# Altium project Syncbox.PrjPcb (part 2 of 4)
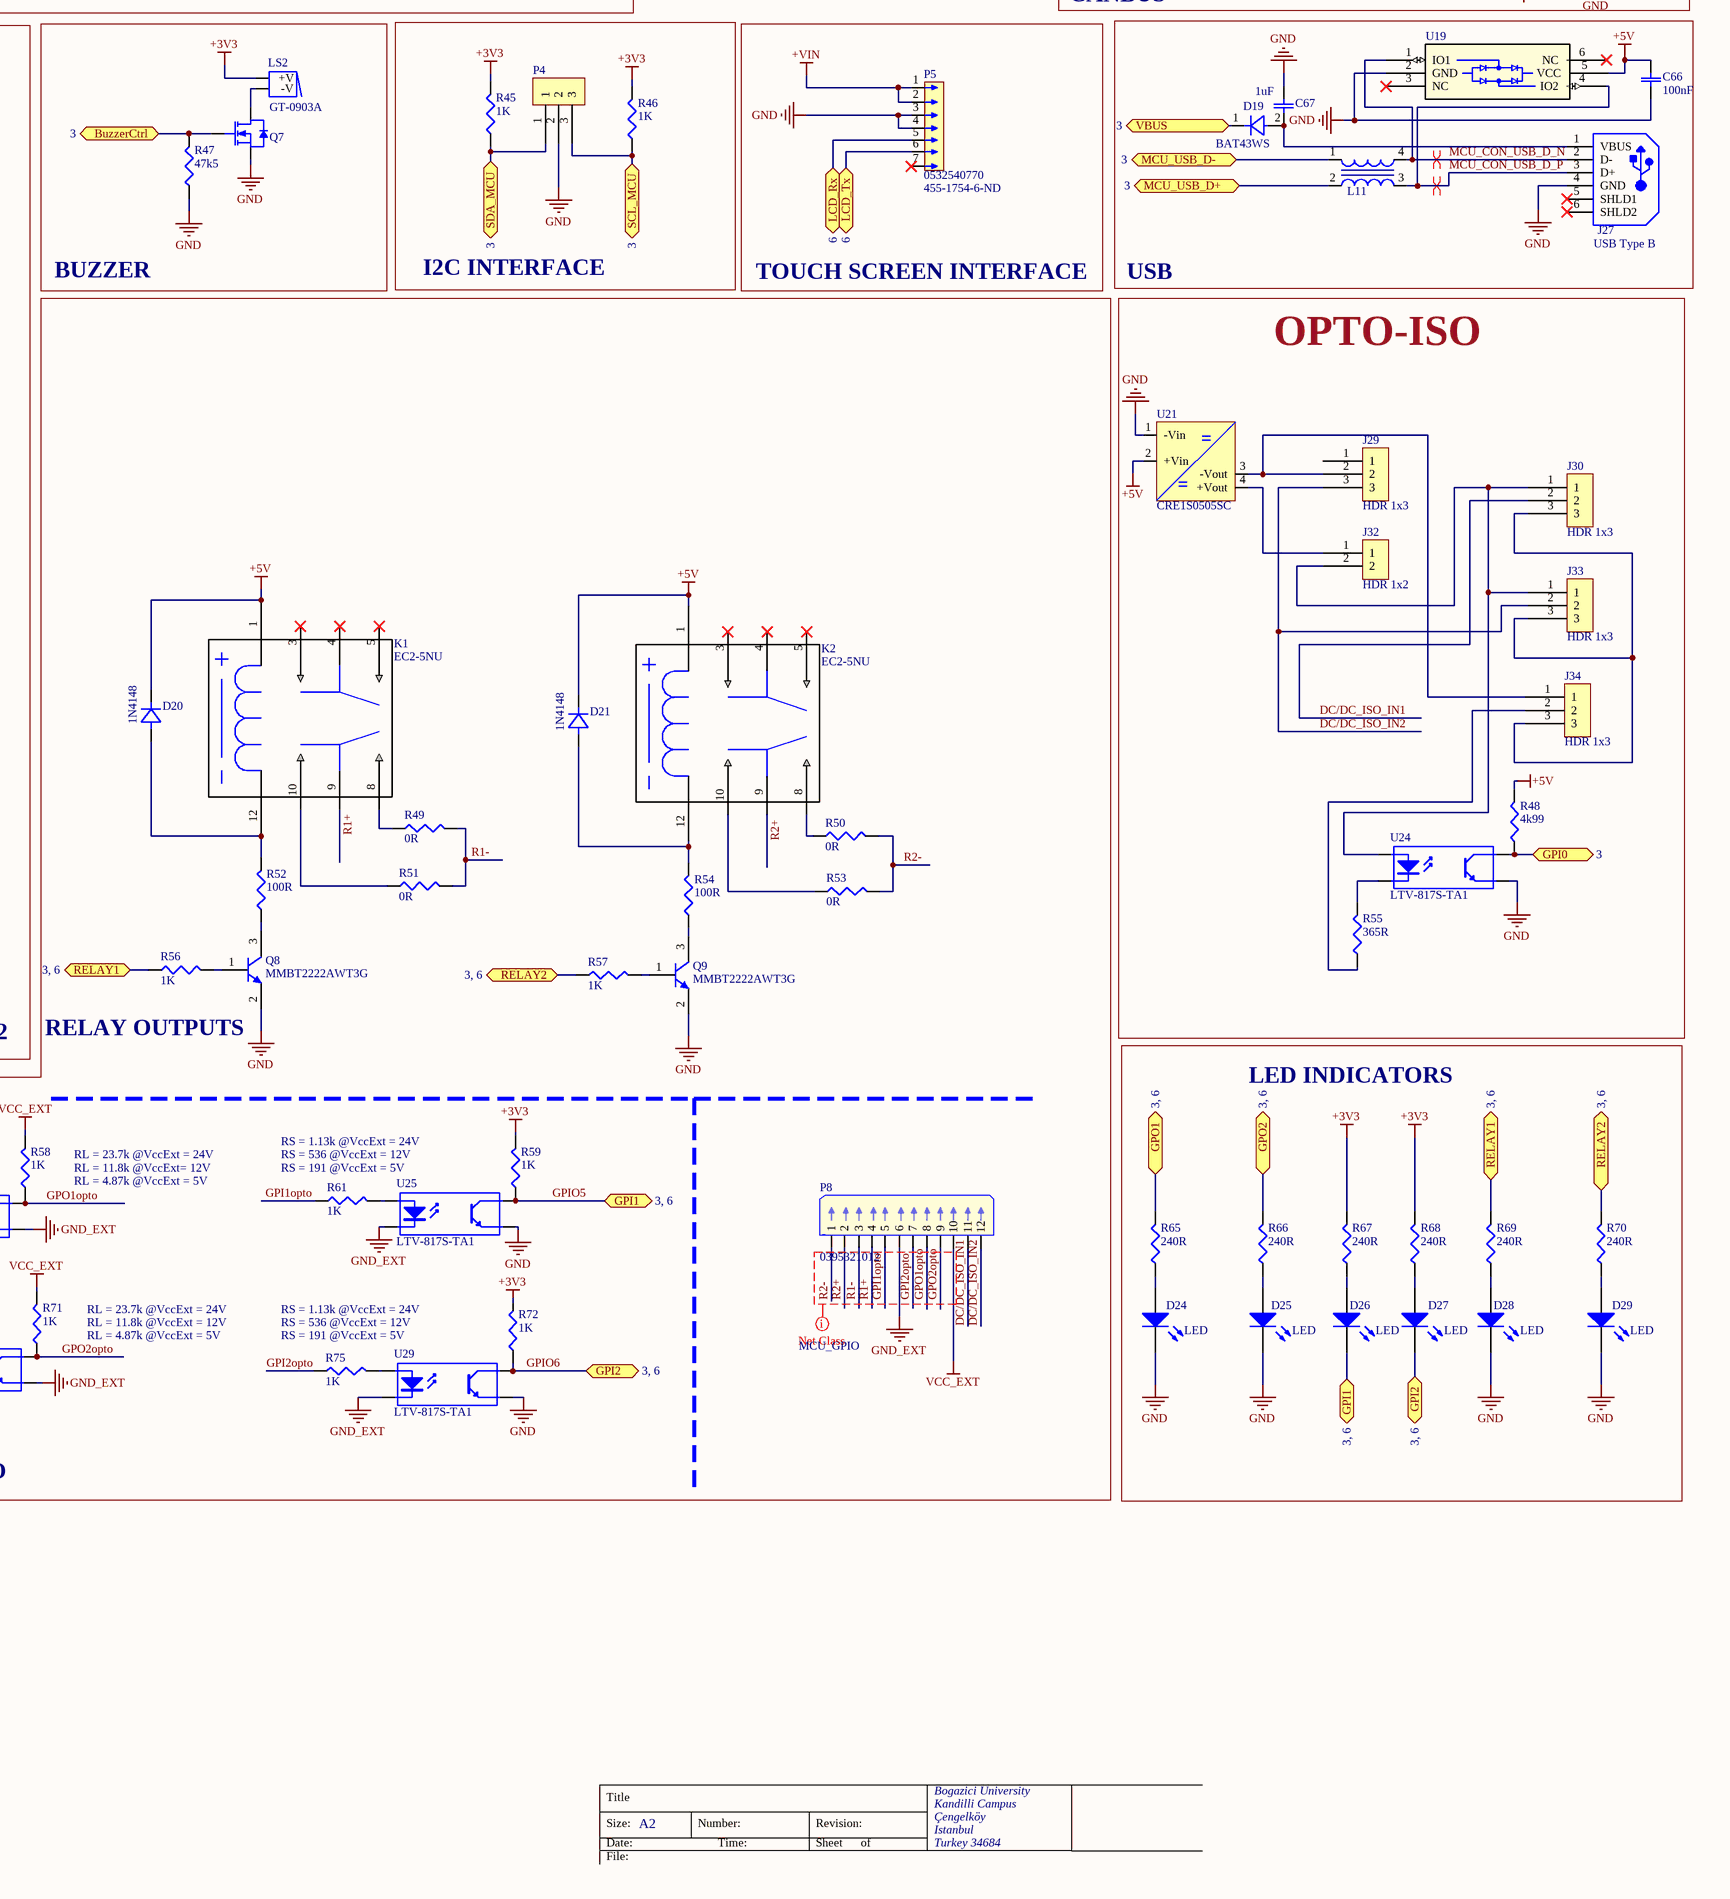
[diagram p9: [06] - MICRO CONTROLLER CONNECTORS.SchDoc, bottom right]

## Sheet [06] - MICRO CONTROLLER CONNECTORS.SchDoc (continued)

### Nets
+3V3: C69.1 C74.2 C79.2 LS2.1(+V) R45.2 R46.2 R59.2 R67.2 R68.2 R72.2 U20.19(VCC) U20.20(/SD) U22.19(VCC) U22.20(/SD) U23.19(VCC) U23.20(/SD)  [project net PWR_OUT2]
+5V: C65.2 C66.2 D20.1 D21.1 K1.1 K2.1 R48.2 U18.3(VCC) U19.5(VCC) U21.2(+Vin) U27.3(Vcc)
+VIN: P5.1 P5.2
GND: C64.2 C65.1 C66.1 C67.2 C69.2 C70.1 C72.1 C74.1 C75.2 C77.2 C79.1 C80.1 C82.1 C83.1 D18.3 D22.3 D24.2(K) D25.2(K) D28.2(K) D29.2(K) J26.2 J27.4(GND) J28.5 J28.14 J28.19 J28.20 J28.21 J28.22 J31.5 J31.14 J31.19 J31.20 J31.21 J31.22 P3.2 P4.2 P5.3 P5.4 P6.2 P7.2 P9.5 Q7.2(S) Q8.2(E) Q9.2(E) R43.2 R47.1 U18.2(GND) U19.2(GND) U20.1(/EN) U20.18(GND) U21.1(-Vin) U22.1(/EN) U22.18(GND) U23.1(/EN) U23.18(GND) U24.3(E) U25.3(E) U26.2(K) U27.6(Gnd) U28.2(K) U29.3(E)  [project net PGND]
GND_EXT: P8.6 U25.2(K) U26.3(E) U28.3(E) U29.2(K)
VCC_EXT: P8.10 R58.2 R71.2
CANH: D18.1 J26.1 R44.2 U18.7(CANH)
CANL: D18.2 J26.3 R44.1 U18.6(CANL)
CON_UART1_RX: J28.12 U20.16(R1I)
CON_UART1_TX: J28.11 U20.17(T1O)
CON_UART2_RX: J28.3 U20.9(R2I)
CON_UART2_TX: J28.2 U20.8(T2O)
CON_UART3_RX: J31.3 U22.16(R1I)
CON_UART3_TX: J31.2 U22.17(T1O)
CON_UART4_RX: J25.2 J31.12
CON_UART4_TX: J22.2 J31.11
DC/DC_ISO_IN1: J30.2 P8.11
DC/DC_ISO_IN2: J29.3 J33.2 P8.12
GPI1opto: P8.5 R61.1
GPI2opto: P8.7 R75.1
GPIO5: D26.2(K) R59.1 U25.4(C) ; port GPI1
GPIO6: D27.2(K) R72.1 U29.4(C) ; port GPI2
GPO1opto: P8.8 R58.1 U26.4(C)
GPO2opto: P8.9 R71.1 U28.4(C)
MCU_CON_USB_D_N: J27.2(D-) L11.4 U19.1(IO1)
MCU_CON_USB_D_P: J27.3(D+) L11.3 U19.4(IO2)
MCU_TRANS_OUT_RX: J15.1 J20.1 J25.1 U22.9(R2I)
MCU_TRANS_OUT_TX: J14.1 J19.1 J22.1 U22.8(T2O)
MCU_TRANS_RX: J17.2 U22.10(R2O)
MCU_TRANS_TX: J16.2 U22.12(T2I)
MCU_UART1_RX: U20.15(R1O) ; port UART1_RX
MCU_UART1_TX: U20.13(T1I) ; port UART1_TX
MCU_UART2_RX: U20.10(R2O) ; port UART2_RX
MCU_UART2_TX: U20.12(T2I) ; port UART2_TX
MCU_UART3_RX: U22.15(R1O) ; port UART3_RX
MCU_UART3_TX: U22.13(T1I) ; port UART3_TX
MCU_UART4_RX: J13.2 J17.1 J24.1 ; port UART4_RX
MCU_UART4_TX: J12.1 J16.1 J23.1 ; port UART4_TX
PC2TRANS_PC_RX: J18.1 U23.15(R1O)
PC2TRANS_PC_TX: J21.2 U23.13(T1I)
R1+: K1.9 P8.4
R1-: P8.3 R49.2 R51.2
R2+: K2.9 P8.2
R2-: P8.1 R50.2 R53.2
RS485_DI: J23.2 U27.5(DI)
RS485_RES_N: D23.1 P9.4 R76.2
RS485_RES_P: D23.2 P9.3 R74.2
RS485_RO: C83.2 J24.2 U27.4(RO)
RS485_SND_N: D22.2 P9.1 R63.2
RS485_SND_P: D22.1 P9.2 R64.2
SER1_RS_RX: P7.1 U23.9(R2I)
SER1_RS_TX: P7.3 U23.8(T2O)
TRANS2LCD_RX: J20.2 P5.6 ; port LCD_Tx
TRANS2LCD_TX: J19.2 P5.5 ; port LCD_Rx
TRANS2TRANS_RX: J15.2 P6.1 U23.17(T1O)
TRANS2TRANS_TX: J14.2 P6.3 U23.16(R1I)
NetC64_1: C64.1 R42.1 R43.1 U18.8(S)
NetC67_1: C67.1 D19.2 J27.1(VBUS)
NetC68_1: C68.1 U20.4(C1-)
NetC68_2: C68.2 U20.2(C1+)
NetC70_2: C70.2 U20.3(V+)
NetC71_1: C71.1 U20.6(C2-)
NetC71_2: C71.2 U20.5(C2+)
NetC72_2: C72.2 U20.7(V-)
NetC73_1: C73.1 U22.2(C1+)
NetC73_2: C73.2 U22.4(C1-)
NetC75_1: C75.1 U22.3(V+)
NetC76_1: C76.1 U22.5(C2+)
NetC76_2: C76.2 U22.6(C2-)
NetC77_1: C77.1 U22.7(V-)
NetC78_1: C78.1 U23.2(C1+)
NetC78_2: C78.2 U23.4(C1-)
NetC80_2: C80.2 U23.3(V+)
NetC81_1: C81.1 U23.5(C2+)
NetC81_2: C81.2 U23.6(C2-)
NetC82_2: C82.2 U23.7(V-)
NetD19_1: D19.1 ; port VBUS
NetD20_2: D20.2 K1.12 R52.2
NetD21_2: D21.2 K2.12 R54.2
NetD24_1: D24.1(A) R65.1
NetD25_1: D25.1(A) R66.1
NetD26_1: D26.1(A) R67.1
NetD27_1: D27.1(A) R68.1
NetD28_1: D28.1(A) R69.1
NetD29_1: D29.1(A) R70.1
NetJ12_2: J12.2 J18.2 P3.1 ; port CPU_SER0_RX
NetJ13_1: J13.1 J21.1 P3.3 ; port CPU_SER0_TX
NetJ29_2: J29.2 J34.1 U21.3(-Vout)
NetJ30_1: J30.1 J32.2 J33.1 U24.1(A)
NetJ30_3: J30.3 J33.3 J34.3
NetJ32_1: J32.1 U21.4(+Vout)
NetJ34_2: J34.2 R55.1
NetK1_8: K1.8 R49.1
NetK1_10: K1.10 R51.1
NetK2_8: K2.8 R50.1
NetK2_10: K2.10 R53.1
NetL11_1: L11.1 ; port MCU_USB_D-
NetL11_2: L11.2 ; port MCU_USB_D+
NetLS2_2: LS2.2(-V) Q7.3(D)
NetP4_1: P4.1 R45.1 ; port SDA_MCU
NetP4_3: P4.3 R46.1 ; port SCL_MCU
NetQ7_1: Q7.1(G) R47.2 ; port BuzzerCtrl
NetQ8_1: Q8.1(B) R56.2
NetQ8_3: Q8.3(C) R52.1
NetQ9_1: Q9.1(B) R57.2
NetQ9_3: Q9.3(C) R54.1
NetR42_2: R42.2 ; port CAN_INH
NetR48_1: R48.1 U24.4(C) ; port GPI0
NetR55_2: R55.2 U24.2(K)
NetR56_1: R56.1 R69.2 ; port RELAY1
NetR57_1: R57.1 R70.2 ; port RELAY2
NetR60_1: R60.1 R76.1 U27.1(B)
NetR60_2: R60.2 R74.1 U27.2(A)
NetR61_2: R61.2 U25.1(A)
NetR62_1: R62.1 R65.2 ; port GPO1
NetR62_2: R62.2 U26.1(A)
NetR63_1: R63.1 U27.8(Z)
NetR64_1: R64.1 U27.7(Y)
NetR66_2: R66.2 R73.1 ; port GPO2
NetR73_2: R73.2 U28.1(A)
NetR75_2: R75.2 U29.1(A)
NetU18_1: U18.1(TXD) ; port CAN_TX
NetU18_4: U18.4(RXD) ; port CAN_RX
NetU23_10: U23.10(R2O) ; port CPU_SER1_RX
NetU23_12: U23.12(T2I) ; port CPU_SER1_TX

Not connected (* = marked no-connect by the designer): D23 3; J27 5(SHLD1)* 6(SHLD2)*; J28 1 4 6 7 8 9 10 13 15 16 17 18; J29 1; J31 1 4 6 7 8 9 10 13 15 16 17 18; K1 3 4 5; K2 3 4 5; P5 7*; U18 5(VREF)*; U19 3(NC)* 6(NC)*; U20 11(NC)* 14(NC)*; U22 11(NC)* 14(NC)*; U23 11(NC)* 14(NC)*

### Layout directives
net class CANBus: CANH, CANL
differential pair; net class DIFF90: MCU_CON_USB_D_N, MCU_CON_USB_D_P
net class MCU_GPIO: GPI1opto, GPI2opto, GPO1opto, GPO2opto, R1+, R1-, R2+, R2-
differential pair; net class DIFF100: RS485_RES_N, RS485_RES_P, RS485_SND_N, RS485_SND_P
net class RS232: CON_UART1_RX, CON_UART1_TX, CON_UART2_RX, CON_UART2_TX, CON_UART3_RX, CON_UART3_TX, CON_UART4_RX, CON_UART4_TX, MCU_TRANS_OUT_RX, MCU_TRANS_OUT_TX, MCU_TRANS_RX, MCU_TRANS_TX, MCU_UART1_RX, MCU_UART1_TX, MCU_UART2_RX, MCU_UART2_TX, MCU_UART3_RX, MCU_UART3_TX

### Notes on the sheet
- MICRO-CONTROLLER CONNECTIONS
- I2C INTERFACE
- TOUCH SCREEN INTERFACE
- RELAY OUTPUTS
- RS = 1.13k @VccExt = 24V
- RL = 23.7k @VccExt = 24V
- RL = 11.8k @VccExt= 12V
- RL = 4.87k @VccExt = 5V
- RS = 536 @VccExt = 12V
- RS = 191 @VccExt = 5V
- RL = 11.8k @VccExt = 12V
- OPTOISOLATED GPIO
- Title
- Bogazici University
- Size:
- Date:
- File:
- A2
- Number:
- Time:
- Revision:
- Sheet
- of
- Kandilli Campus
- Çengelköy
- Istanbul
- Turkey 34684